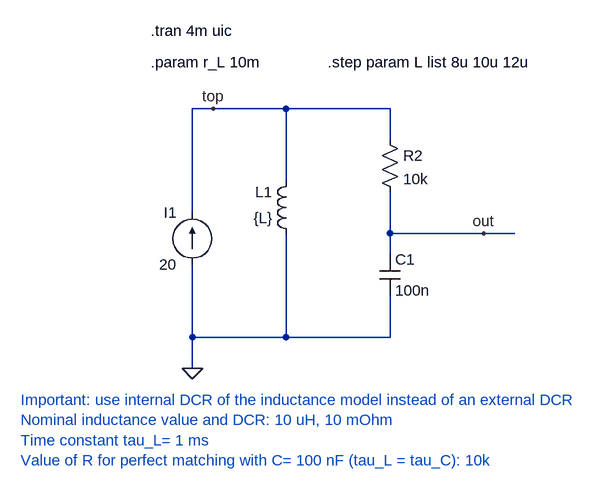
[diagram p0: schematic DCR Step response.asc]
DCR Step response.asc, the LTspice schematic file:
Version 4
SHEET 1 1316 680
WIRE 256 -288 224 -288
WIRE 368 -288 256 -288
WIRE 528 -288 368 -288
WIRE 528 -240 528 -288
WIRE 368 -176 368 -288
WIRE 224 -128 224 -288
WIRE 528 -96 528 -160
WIRE 672 -96 528 -96
WIRE 720 -96 672 -96
WIRE 528 -64 528 -96
WIRE 224 64 224 -48
WIRE 368 64 368 -96
WIRE 368 64 224 64
WIRE 528 64 528 0
WIRE 528 64 368 64
WIRE 224 112 224 64
FLAG 224 112 0
FLAG 672 -96 out
FLAG 256 -288 top
SYMBOL current 224 -48 R180
WINDOW 0 24 80 Left 2
WINDOW 3 24 0 Left 2
WINDOW 123 0 0 Left 0
WINDOW 39 0 0 Left 0
SYMATTR InstName I1
SYMATTR Value 20
SYMBOL ind 384 -80 R180
WINDOW 0 36 80 Left 2
WINDOW 3 36 40 Left 2
SYMATTR InstName L1
SYMATTR Value {L}
SYMATTR SpiceLine Rser={r_L}
SYMBOL res 512 -256 R0
SYMATTR InstName R2
SYMATTR Value 10k
SYMBOL cap 512 -64 R0
SYMATTR InstName C1
SYMATTR Value 100n
TEXT 160 -408 Left 2 !.tran 4m uic
TEXT 432 -360 Left 2 !.step param L list 8u 10u 12u
TEXT -40 160 Left 2 ;Important: use internal DCR of the inductance model instead of an external DCR\nNominal inductance value and DCR: 10 uH, 10 mOhm\nTime constant tau_L= 1 ms\nValue of R for perfect matching with C= 100 nF (tau_L = tau_C): 10k
TEXT 160 -360 Left 2 !.param r_L 10m

The netlist it stands for:
* DCR Step response.asc
I1 0 top 20
L1 0 top {L} Rser={r_L}
R2 top out 10k
C1 out 0 100n
.tran 4m uic
.step param L list 8u 10u 12u
* Important: use internal DCR of the inductance model instead of an external DCR
* Nominal inductance value and DCR: 10 uH, 10 mOhm
* Time constant tau_L= 1 ms
* Value of R for perfect matching with C= 100 nF (tau_L = tau_C): 10k
.param r_L 10m
.backanno
.end